# Altium schematic sheet SDRAM.SchDoc
size A4
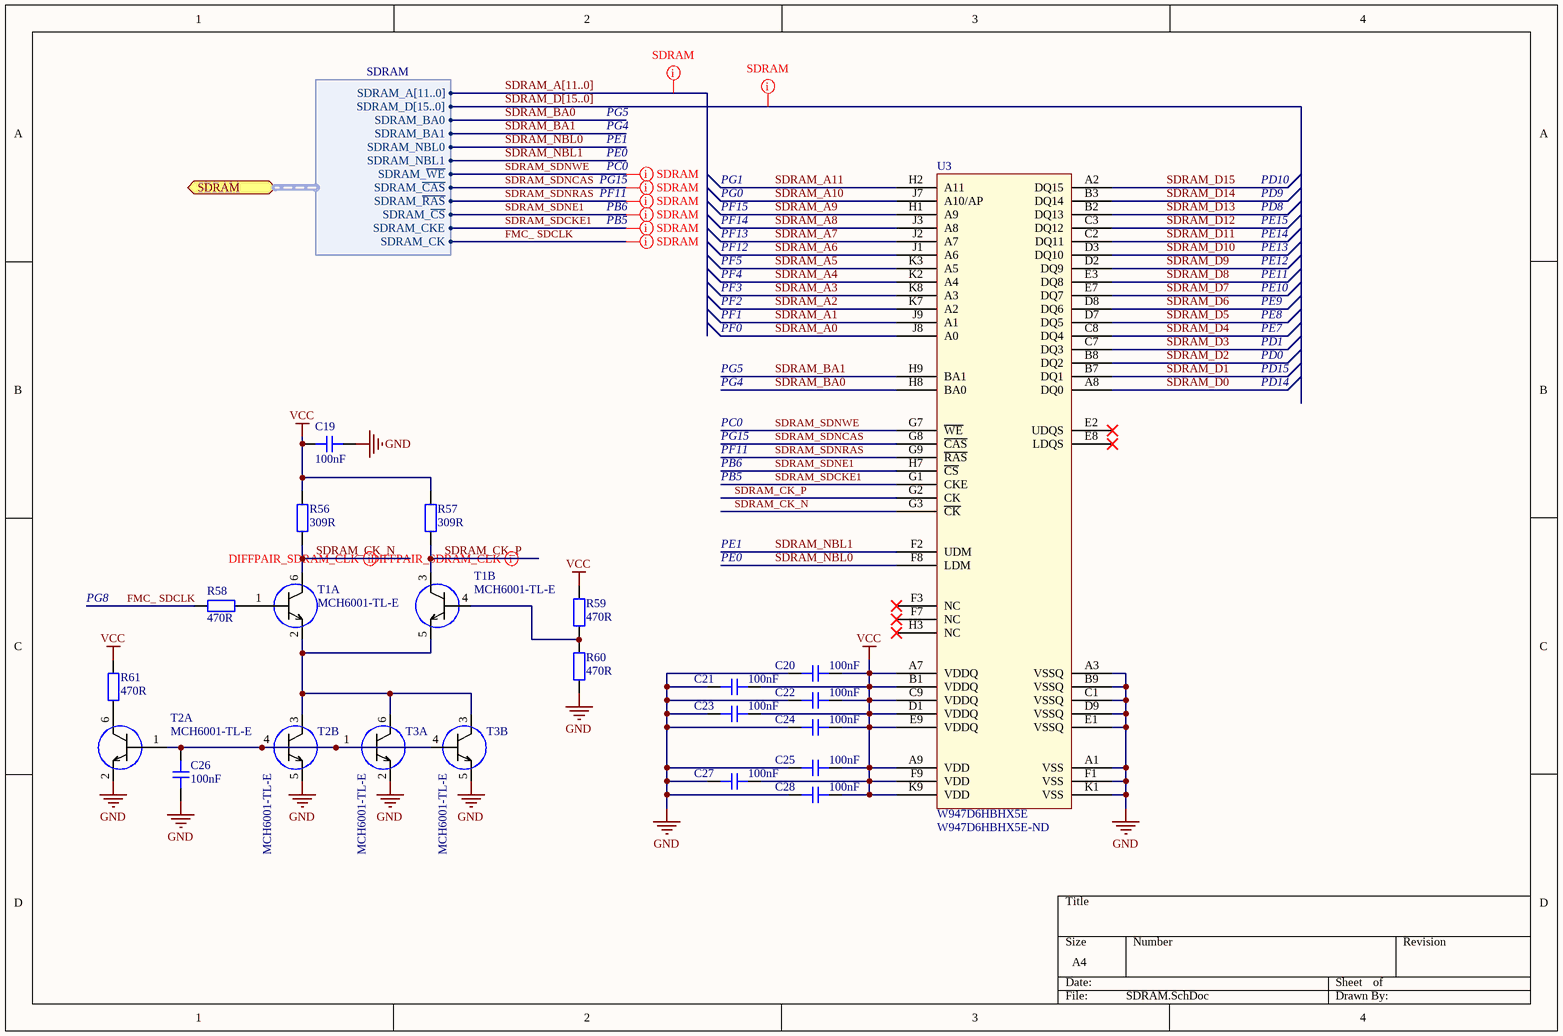
[diagram p0: SDRAM.SchDoc]

## Parts
C19  value 100nF  [Capacitor-0603]  (hidden comment: C-100nF-0603)
C20  value 100nF  [Capacitor-0603]  (hidden comment: C-100nF-0603)
C21  value 100nF  [Capacitor-0603]  (hidden comment: C-100nF-0603)
C22  value 100nF  [Capacitor-0603]  (hidden comment: C-100nF-0603)
C23  value 100nF  [Capacitor-0603]  (hidden comment: C-100nF-0603)
C24  value 100nF  [Capacitor-0603]  (hidden comment: C-100nF-0603)
C25  value 100nF  [Capacitor-0603]  (hidden comment: C-100nF-0603)
C26  value 100nF  [Capacitor-0603]  (hidden comment: C-100nF-0603)
C27  value 100nF  [Capacitor-0603]  (hidden comment: C-100nF-0603)
C28  value 100nF  [Capacitor-0603]  (hidden comment: C-100nF-0603)
R56  value 309R  [Resistor-0603]  (hidden comment: R-309R-0603)
R57  value 309R  [Resistor-0603]  (hidden comment: R-309R-0603)
R58  value 470R  [Resistor-0603]  (hidden comment: R-470R-0603)
R59  value 470R  [Resistor-0603]  (hidden comment: R-470R-0603)
R60  value 470R  [Resistor-0603]  (hidden comment: R-470R-0603)
R61  value 470R  [Resistor-0603]  (hidden comment: R-470R-0603)
T1  MCH6001-TL-E  [MCH6001-TL-E]  (parts A,B of 2)
T2  MCH6001-TL-E  [MCH6001-TL-E]  (parts A,B of 2)
T3  MCH6001-TL-E  [MCH6001-TL-E]  (parts A,B of 2)
U3  W947D6HBHX5E  Supplier Part Number 1: W947D6HBHX5E-ND  [W947D6HBHX5E]

## Ports
SDRAM (bidir, harness SDRAM)

## Harnesses
SDRAM: SDRAM_A[11..0], SDRAM_D[15..0], SDRAM_BA0, SDRAM_BA1, SDRAM_NBL0, SDRAM_NBL1, SDRAM_~{WE}, SDRAM_~{CAS}, SDRAM_~{RAS}, SDRAM_~{CS}, SDRAM_CKE, SDRAM_CK

## Nets
GND: C19.1 C20.1 C21.1 C22.1 C23.1 C24.1 C25.1 C26.1 C27.1 C28.1 R60.2 T2.2(E1) T2.5(E2) T3.2(E1) T3.5(E2) U3.A1(VSS) U3.A3(VSSQ) U3.B9(VSSQ) U3.C1(VSSQ) U3.D9(VSSQ) U3.E1(VSSQ) U3.F1(VSS) U3.K1(VSS)
VCC: C19.2 C20.2 C21.2 C22.2 C23.2 C24.2 C25.2 C27.2 C28.2 R56.2 R57.2 R59.1 R61.2 U3.A7(VDDQ) U3.A9(VDD) U3.B1(VDDQ) U3.C9(VDDQ) U3.D1(VDDQ) U3.E9(VDDQ) U3.F9(VDD) U3.K9(VDD)
FMC_ SDCLK: R58.2 ; port SDRAM.SDRAM_CK
SDRAM_A0: U3.J8(A0)
SDRAM_A1: U3.J9(A1)
SDRAM_A2: U3.K7(A2)
SDRAM_A3: U3.K8(A3)
SDRAM_A4: U3.K2(A4)
SDRAM_A5: U3.K3(A5)
SDRAM_A6: U3.J1(A6)
SDRAM_A7: U3.J2(A7)
SDRAM_A8: U3.J3(A8)
SDRAM_A9: U3.H1(A9)
SDRAM_A10: U3.J7(A10/AP)
SDRAM_A11: U3.H2(A11)
SDRAM_BA0: U3.H8(BA0) ; port SDRAM.SDRAM_BA0
SDRAM_BA1: U3.H9(BA1) ; port SDRAM.SDRAM_BA1
SDRAM_CK_N: R56.1 T1.6(C1) U3.G3(~{CK})
SDRAM_CK_P: R57.1 T1.3(C2) U3.G2(CK)
SDRAM_D0: U3.A8(DQ0)
SDRAM_D1: U3.B7(DQ1)
SDRAM_D2: U3.B8(DQ2)
SDRAM_D3: U3.C7(DQ3)
SDRAM_D4: U3.C8(DQ4)
SDRAM_D5: U3.D7(DQ5)
SDRAM_D6: U3.D8(DQ6)
SDRAM_D7: U3.E7(DQ7)
SDRAM_D8: U3.E3(DQ8)
SDRAM_D9: U3.D2(DQ9)
SDRAM_D10: U3.D3(DQ10)
SDRAM_D11: U3.C2(DQ11)
SDRAM_D12: U3.C3(DQ12)
SDRAM_D13: U3.B2(DQ13)
SDRAM_D14: U3.B3(DQ14)
SDRAM_D15: U3.A2(DQ15)
SDRAM_NBL0: U3.F8(LDM) ; port SDRAM.SDRAM_NBL0
SDRAM_NBL1: U3.F2(UDM) ; port SDRAM.SDRAM_NBL1
SDRAM_SDCKE1: U3.G1(CKE) ; port SDRAM.SDRAM_CKE
SDRAM_SDNCAS: U3.G8(~{CAS}) ; port SDRAM.SDRAM_~{CAS}
SDRAM_SDNE1: U3.H7(~{CS}) ; port SDRAM.SDRAM_~{CS}
SDRAM_SDNRAS: U3.G9(~{RAS}) ; port SDRAM.SDRAM_~{RAS}
SDRAM_SDNWE: U3.G7(~{WE}) ; port SDRAM.SDRAM_~{WE}
NetC26_2: C26.2 T2.1(B1) T2.4(B2) T3.1(B1) T3.4(B2)
NetR58_1: R58.1 T1.1(B1)
NetR59_2: R59.2 R60.1 T1.4(B2)
NetR61_1: R61.1 T2.6(C1)
NetT1_2: T1.2(E1) T1.5(E2) T2.3(C2) T3.3(C2) T3.6(C1)

Not connected (* = marked no-connect by the designer): U3 E2(UDQS)* E8(LDQS)* F3(NC)* F7(NC)* H3(NC)*

## Buses and harness runs
bus SDRAM_A[11..0]
bus SDRAM_D[15..0]

## Layout directives
differential pair: SDRAM_CK_N, SDRAM_CK_P
mark named SDRAM: (no net found under the mark), FMC_ SDCLK, SDRAM_SDCKE1, SDRAM_SDNCAS, SDRAM_SDNE1, SDRAM_SDNRAS, SDRAM_SDNWE

## Notes on the sheet
- PG5
- PG4
- PC0
- PE1
- PE0
- PG15
- PF11
- PB6
- PB5
- PG1
- PG0
- PF15
- PF14
- PF13
- PF12
- PD10
- PD9
- PD8
- PE15
- PE14
- PE13
- PF5
- PF4
- PF3
- PF2
- PE12
- PE11
- PE10
- PE9
- PF1
- PF0
- PE8
- PE7
- PD1
- PD0
- PD15
- PD14
- PG8

## Library data of the parts
C19-C28 = C-100nF-0603: Supplier 1: Digi-Key; Supplier Part Number 1: 1276-1006-1-ND
R56 R57 = R-309R-0603: Supplier 1: Digi-Key; Supplier Part Number 1: 311-309HRCT-ND
R58-R61 = R-470R-0603: Supplier 1: Digi-Key; Supplier Part Number 1: 311-470HRCT-ND
T1-T3 = MCH6001-TL-E: Supplier 1: Mouser; Supplier Part Number 1: 863-MCH6001-TL-E
U3 = W947D6HBHX5E: Supplier 1: Digi-Key